# Altium schematic sheet Stepper_Driver.SchDoc: Title
size A4; Date: *******; ApprovedBy: *******; CheckedBy: None; Author: *******; CompanyName: *******; DrawnBy: Name; Engineer: *******; Organization: *******; Address1: *******; Address2: *******; Address3: *******; Address4: *******; DocumentNumber: 3; Revision: *******; SheetNumber: 3; SheetTotal: 11; CurrentTime: *******; CurrentDate: *******; Time: *******; DocumentFullPathAndName: *******; DocumentName: *******; ModifiedDate: *******; ImagePath: *******; ProjectName: *******; Application_BuildNumber: *******
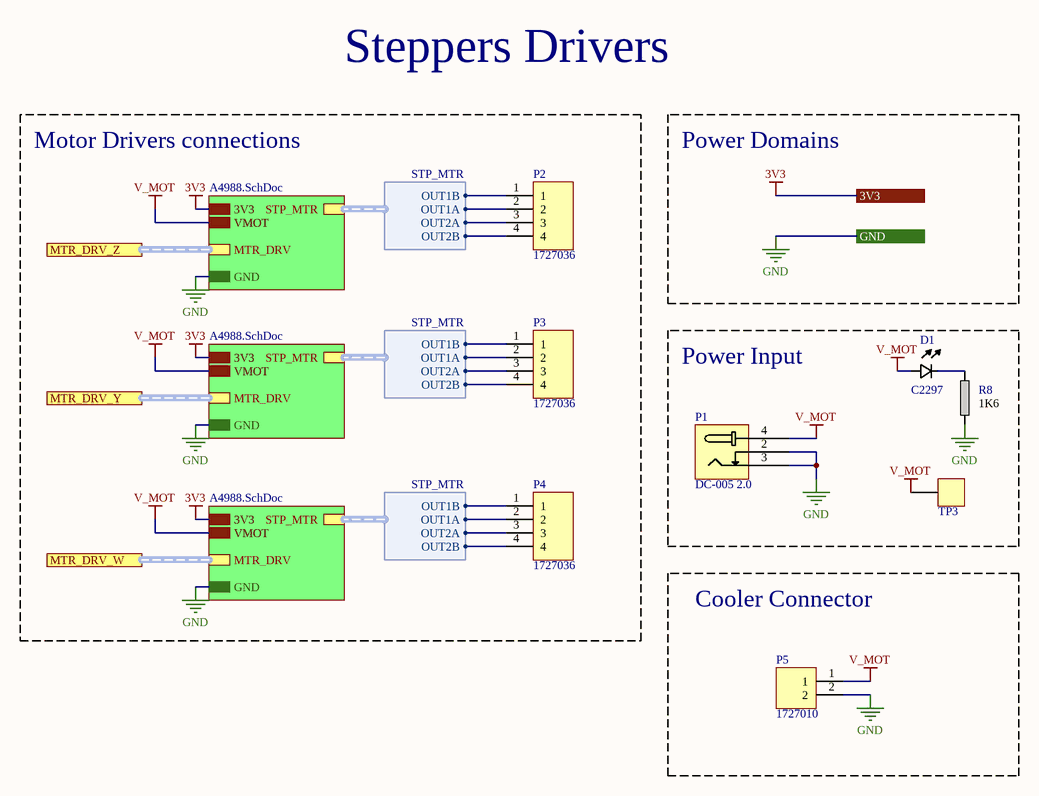
[diagram p0: Stepper_Driver.SchDoc]

## Parts
D1  Manufacturer Part Number: C2297  [0805]  (hidden comment: LED)
P1  DC-005 2.0  [DC-005 2.0]
P2  MOTOR Z  [1727036]  (value not drawn)
P3  MOTOR Y  [1727036]  (value not drawn)
P4  MOTOR W  [1727036]  (value not drawn)
P5  BORNERA SR-2  [1727010]  (value not drawn)
R8  value 1K6  [0805]  (hidden comment: RES)
TP3  12V  [5015]  (value not drawn)

## Blocks framed on the sheet
Motor Drivers connections: P2-P4
Power Input: D1 P1 R8 TP3
Cooler Connector: P5

## Sub-sheets
U_A4988 = A4988.SchDoc: MTR_DRV (harness MTR_DRV), STP_MTR (harness STP_MTR), 3V3, GND, VMOT
U_A4988 = A4988.SchDoc: MTR_DRV (harness MTR_DRV), STP_MTR (harness STP_MTR), 3V3, GND, VMOT
U_A4988 = A4988.SchDoc: MTR_DRV (harness MTR_DRV), STP_MTR (harness STP_MTR), 3V3, GND, VMOT

## Ports
3V3 (see Lens-Maker[3A], A4988[3B], ESP32_Block[3C], ESP32_Module[3B], GPIO_Header[3B], I2C_Header[3B], Power[3B], SPI_Header[3B]), GND (see Lens-Maker[3B], A4988[3B], ESP32_Block[3D], ESP32_Module[3B], GPIO_Header[3B], I2C_Header[3B], Mechanical_Holes[3B], Power[3C], SPI_Header[3B], USB_Connector[3B]), MTR_DRV_W (harness MTR_DRV, see Lens-Maker[3B]), MTR_DRV_Y (harness MTR_DRV, see Lens-Maker[3B]), MTR_DRV_Z (harness MTR_DRV, see Lens-Maker[3B])

## Harnesses
STP_MTR: OUT1A, OUT1B, OUT2A, OUT2B

## Nets
3V3: port 3V3, sheet U_A4988/3V3, sheet U_A4988/3V3, sheet U_A4988/3V3
GND: P1.2 P1.3 P5.2 R8.1 ; port GND, sheet U_A4988/GND, sheet U_A4988/GND, sheet U_A4988/GND
V_MOT: D1.1 P1.4 P5.1 TP3.1 ; sheet U_A4988/VMOT, sheet U_A4988/VMOT, sheet U_A4988/VMOT
NetD1_2: D1.2 R8.2
NetP2_1: P2.1 ; sheet U_A4988/STP_MTR.OUT1B
NetP2_2: P2.2 ; sheet U_A4988/STP_MTR.OUT1A
NetP2_3: P2.3 ; sheet U_A4988/STP_MTR.OUT2A
NetP2_4: P2.4 ; sheet U_A4988/STP_MTR.OUT2B
NetP3_1: P3.1 ; sheet U_A4988/STP_MTR.OUT1B
NetP3_2: P3.2 ; sheet U_A4988/STP_MTR.OUT1A
NetP3_3: P3.3 ; sheet U_A4988/STP_MTR.OUT2A
NetP3_4: P3.4 ; sheet U_A4988/STP_MTR.OUT2B
NetP4_1: P4.1 ; sheet U_A4988/STP_MTR.OUT1B
NetP4_2: P4.2 ; sheet U_A4988/STP_MTR.OUT1A
NetP4_3: P4.3 ; sheet U_A4988/STP_MTR.OUT2A
NetP4_4: P4.4 ; sheet U_A4988/STP_MTR.OUT2B

## Buses and harness runs
harness port MTR_DRV_W = sheet U_A4988/MTR_DRV
harness port MTR_DRV_Y = sheet U_A4988/MTR_DRV
harness port MTR_DRV_Z = sheet U_A4988/MTR_DRV

## Notes on the sheet
- Steppers Drivers
- Power Domains
- Title:
- Size:
- Date:
- Drawn By:
- Page Contents:
- A4
- Checked By:
- Revision:
- Sheet
- of

## Library data of the parts
D1 = LED: 0805 Light Emitting Diodes (LED) ROHS; Manufacturer: Hubei KENTO Elec; Supplier: JLCPCB; Supplier Part Number: C2297
P1 = DC-005 2.0: Shrouded DC Power Receptacle 2mm 6.4mm Plugin AC/DC Power Connectors ROHS; Manufacturer: BOOMELE(Boom Precision Elec); Supplier: JLCPCB; Supplier Part Number: C16214; Manufacturer Part Number: DC-005 2.0
P2-P4 = BORNERA SR-4: TERM BLK 4P SIDE ENT 3.81MM PCB; Manufacturer: Phoenix Contact; Supplier: JLCPCB; Supplier Part Number: C457200; Manufacturer Part Number: 1727036
P5 = BORNERA SR-2: TERM BLK 2P SIDE ENT 3.81MM PCB; Manufacturer: Phoenix Contact; Supplier: JLCPCB; Supplier Part Number: C89123; Manufacturer Part Number: 1727010
R8 = RES: 125mW Thick Film Resistors ±1% 1.6kΩ 0805  Chip Resistor - Surface Mount ROHS; Manufacturer: Resistor.Today; Manufacturer Part Number: AECR0805F1K60K9; Supplier: JLCPCB; Supplier Part Number: C352253
TP3 = TESTPOINT_5015: Thimble/Copper Rod/Test Ring ROHS; Manufacturer: Ronghe; Manufacturer Part Number: RH-5015; Supplier: JLCPCB; Supplier Part Number: C5199798